# EAGLE schematic Flipdot_Control (EAGLE 9.2.2)
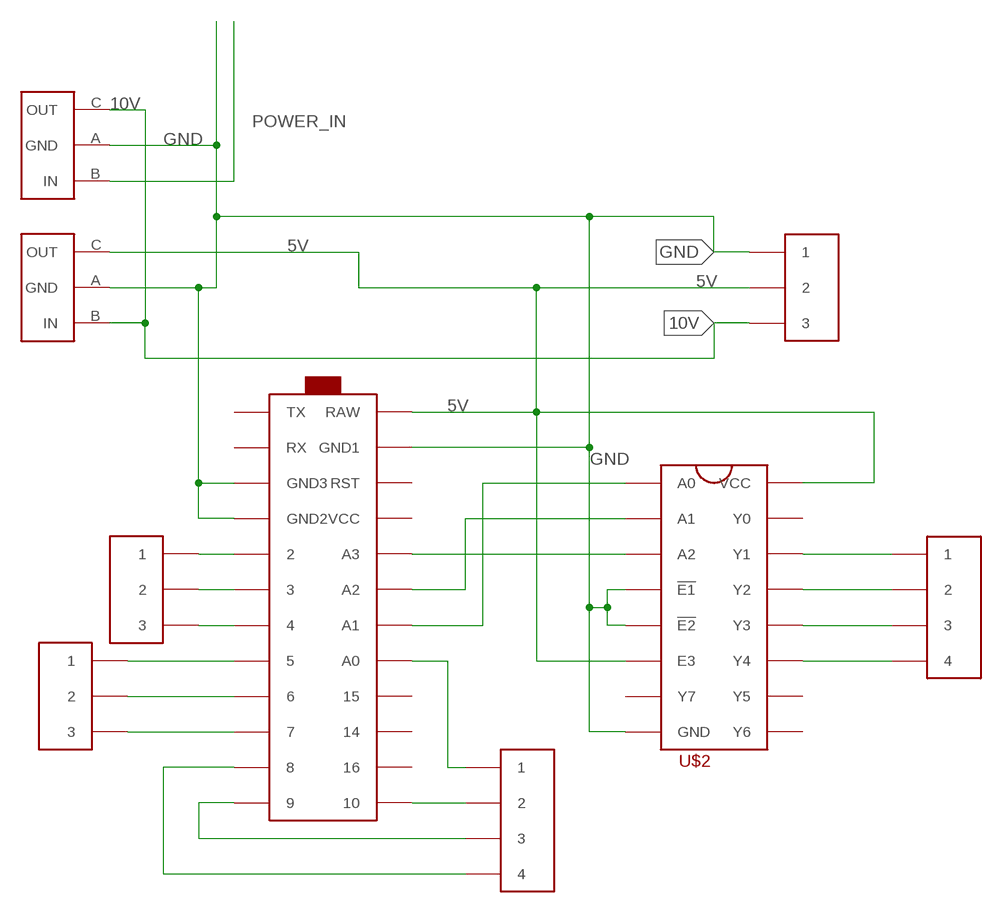
[diagram p0: schematic, sheet 1]

## Parts
U$1  MCU  [SPARKFUN_PRO_MICRO]
U$2  74HC238  [DIL16]
U$3  4_PIN  [4_PIN]
U$4  4_PIN  [4_PIN]
U$5  3_PIN  [3_PIN]
U$6  3_PIN  [3_PIN]
U$7  3_PIN  [3_PIN]
U$8  POWER  [POWER]
U$9  POWER  [POWER]

## Nets
5V: U$1.24(RAW) U$2.6(E3) U$2.16(VCC) U$7.P$2 U$8.C(OUT)
10V: U$7.P$3 U$8.B(IN) U$9.C(OUT)
GND: U$1.3(GND3) U$1.4(GND2) U$1.23(GND1) U$2.4(!E1) U$2.5(!E2) U$2.8(GND) U$7.P$1 U$8.A(GND) U$9.A(GND)
N$1: U$2.14(Y1) U$3.P$1
N$2: U$2.13(Y2) U$3.P$2
N$3: U$2.12(Y3) U$3.P$3
N$4: U$2.11(Y4) U$3.P$4
N$5: U$1.18(A1) U$2.1(A0)
N$6: U$1.19(A2) U$2.2(A1)
N$7: U$1.20(A3) U$2.3(A2)
N$8: U$1.13 U$4.P$2
N$9: U$1.12 U$4.P$3
N$10: U$1.11 U$4.P$4
N$11: U$1.5 U$5.P$1
N$12: U$1.6 U$5.P$2
N$13: U$1.7 U$5.P$3
N$14: U$1.8 U$6.P$1
N$15: U$1.9 U$6.P$2
N$16: U$1.10 U$6.P$3
N$17: U$1.17(A0) U$4.P$1
POWER_IN: U$9.B(IN)
Unconnected: U$1.1(TX) U$1.2(RX) U$1.14 U$1.15 U$1.16 U$1.21(VCC) U$1.22(RST) U$2.7(Y7) U$2.9(Y6) U$2.10(Y5) U$2.15(Y0)

## Library data of the parts
U$1 = Flipdot:MCU
U$2 = Flipdot:74HC238: Demultiplexer
U$3 U$4 = Flipdot:4_PIN
U$5-U$7 = Flipdot:3_PIN
U$8 U$9 = Flipdot:POWER